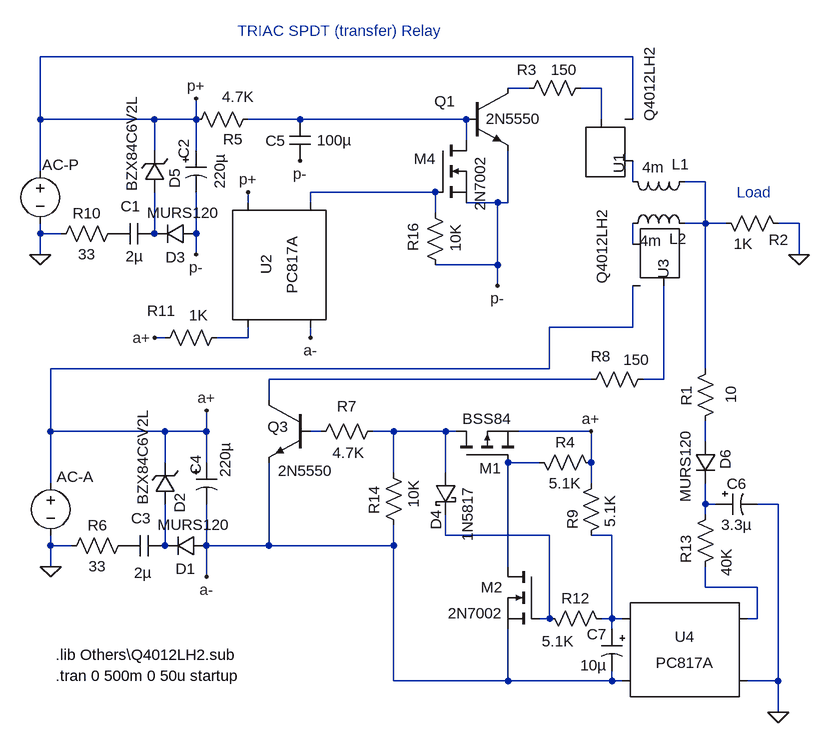
[diagram p0: schematic Simple SPDT Solid State Transfer Switch Using TRIACs (Brian Cornell).asc]
Simple SPDT Solid State Transfer Switch Using TRIACs (Brian Cornell).asc, the LTspice schematic file:
Version 4
SHEET 1 2328 916
WIRE 1696 -112 784 -112
WIRE 1536 -64 1504 -64
WIRE 1648 -64 1616 -64
WIRE 784 -16 784 -112
WIRE 960 -16 784 -16
WIRE 1024 -16 1024 -48
WIRE 1024 -16 960 -16
WIRE 1184 -16 1104 -16
WIRE 1440 -16 1184 -16
WIRE 1648 -16 1648 -64
WIRE 1696 -16 1696 -112
WIRE 1440 16 1440 -16
WIRE 960 32 960 -16
WIRE 1024 32 1024 -16
WIRE 784 64 784 -16
WIRE 1696 80 1696 48
WIRE 1808 80 1776 80
WIRE 1392 96 1200 96
WIRE 1104 112 1104 96
WIRE 1200 112 1200 96
WIRE 1488 112 1440 112
WIRE 1504 112 1504 32
WIRE 1504 112 1488 112
WIRE 1392 128 1392 96
WIRE 1808 144 1808 80
WIRE 1808 144 1776 144
WIRE 1840 144 1808 144
WIRE 1952 144 1920 144
WIRE 784 160 784 144
WIRE 816 160 784 160
WIRE 960 160 960 96
WIRE 1024 160 1024 96
WIRE 1696 176 1696 144
WIRE 784 192 784 160
WIRE 1024 192 1024 160
WIRE 1952 192 1952 144
WIRE 1488 208 1488 112
WIRE 1488 208 1392 208
WIRE 1488 240 1488 208
WIRE 1696 304 1696 240
WIRE 1696 304 1568 304
WIRE 976 320 960 320
WIRE 1104 320 1104 304
WIRE 1104 320 1056 320
WIRE 1200 320 1200 304
WIRE 1568 368 1568 304
WIRE 1568 368 800 368
WIRE 1808 368 1808 144
WIRE 1632 384 1136 384
WIRE 1744 384 1744 240
WIRE 1744 384 1712 384
WIRE 1136 416 1136 384
WIRE 800 464 800 368
WIRE 976 464 800 464
WIRE 1040 464 1040 432
WIRE 1040 464 976 464
WIRE 1216 464 1200 464
WIRE 1328 464 1296 464
WIRE 1408 464 1328 464
WIRE 1424 464 1408 464
WIRE 1632 464 1520 464
WIRE 1808 480 1808 448
WIRE 976 512 976 464
WIRE 1040 512 1040 464
WIRE 1552 512 1504 512
WIRE 1632 512 1632 464
WIRE 1328 528 1328 464
WIRE 1408 528 1408 464
WIRE 800 544 800 464
WIRE 1632 544 1632 512
WIRE 1808 576 1808 544
WIRE 1824 576 1808 576
WIRE 1920 576 1888 576
WIRE 1808 592 1808 576
WIRE 1408 624 1408 592
WIRE 1568 624 1408 624
WIRE 1664 624 1632 624
WIRE 800 640 800 624
WIRE 832 640 800 640
WIRE 976 640 976 576
WIRE 1040 640 1040 576
WIRE 1136 640 1136 512
WIRE 1136 640 1040 640
WIRE 1328 640 1328 608
WIRE 1328 640 1136 640
WIRE 800 672 800 640
WIRE 1504 672 1504 512
WIRE 1040 688 1040 640
WIRE 1808 704 1808 672
WIRE 1888 704 1808 704
WIRE 1568 752 1568 624
WIRE 1568 752 1552 752
WIRE 1664 752 1664 624
WIRE 1664 752 1648 752
WIRE 1680 752 1664 752
WIRE 1888 752 1888 704
WIRE 1888 752 1872 752
WIRE 1664 768 1664 752
WIRE 1328 848 1328 640
WIRE 1504 848 1504 768
WIRE 1504 848 1328 848
WIRE 1664 848 1664 832
WIRE 1664 848 1504 848
WIRE 1680 848 1664 848
WIRE 1920 848 1920 576
WIRE 1920 848 1872 848
WIRE 1920 896 1920 848
FLAG 1104 96 p+
FLAG 1040 432 a+
FLAG 784 192 0
FLAG 800 672 0
FLAG 1952 192 0
FLAG 1024 -48 p+
FLAG 1024 192 p-
FLAG 1488 240 p-
FLAG 1040 688 a-
FLAG 1200 320 a-
FLAG 960 320 a+
FLAG 1184 48 p-
FLAG 1920 896 0
FLAG 1632 464 a+
SYMBOL voltage 784 48 R0
WINDOW 3 -151 53 Invisible 2
WINDOW 123 0 0 Left 0
WINDOW 39 0 0 Left 0
WINDOW 0 3 6 Left 2
SYMATTR Value SINE(0 170 60)
SYMATTR InstName AC-P
SYMBOL res 1936 160 M270
WINDOW 0 -25 15 VTop 2
WINDOW 3 0 70 VBottom 2
SYMATTR InstName R2
SYMATTR Value 1K
SYMBOL Misc\\TRIAC 1664 48 M180
WINDOW 0 11 -20 VRight 2
WINDOW 3 58 61 VRight 2
SYMATTR InstName U1
SYMATTR Value Q4012LH2
SYMBOL voltage 800 528 R0
WINDOW 3 -235 55 Invisible 2
WINDOW 123 0 0 Left 0
WINDOW 39 0 0 Left 0
WINDOW 0 9 6 Left 2
SYMATTR Value SINE(0 130 60 200m 0 180)
SYMATTR InstName AC-A
SYMBOL cap 960 144 R90
WINDOW 0 -11 37 VBottom 2
WINDOW 3 35 31 VTop 2
SYMATTR InstName C1
SYMATTR Value 2µ
SYMATTR SpiceLine V=250
SYMBOL res 800 176 R270
WINDOW 0 32 56 VTop 2
WINDOW 3 0 56 VBottom 2
SYMATTR InstName R10
SYMATTR Value 33
SYMBOL diode 1024 144 R90
WINDOW 0 68 32 VBottom 2
WINDOW 3 -32 20 VTop 2
SYMATTR InstName D3
SYMATTR Value MURS120
SYMBOL polcap 1008 32 R0
WINDOW 0 -3 -17 VRight 2
WINDOW 3 52 5 VRight 2
SYMATTR InstName C2
SYMATTR Value 220µ
SYMATTR SpiceLine V=25 Irms=370m Rser=0.24 Lser=0
SYMBOL zener 976 96 R180
WINDOW 0 -15 5 VRight 2
WINDOW 3 51 1 VRight 2
SYMATTR InstName D5
SYMATTR Value BZX84C6V2L
SYMBOL res 1120 -32 R90
WINDOW 0 62 39 VBottom 2
WINDOW 3 -34 31 VTop 2
SYMATTR InstName R5
SYMATTR Value 4.7K
SYMBOL res 1408 224 R180
WINDOW 0 50 37 VRight 2
WINDOW 3 -15 36 VRight 2
SYMATTR InstName R16
SYMATTR Value 10K
SYMBOL nmos 1392 16 R0
WINDOW 0 -33 29 Left 2
WINDOW 3 69 24 VRight 2
SYMATTR InstName M4
SYMATTR Value 2N7002
SYMBOL npn 1440 -64 R0
WINDOW 0 -49 20 Left 2
WINDOW 3 30 47 Left 2
SYMATTR InstName Q1
SYMATTR Value 2N5550
SYMBOL res 1632 -80 R90
WINDOW 0 3 99 VBottom 2
WINDOW 3 -28 42 VTop 2
SYMATTR InstName R3
SYMATTR Value 150
SYMBOL cap 976 624 R90
WINDOW 0 -11 37 VBottom 2
WINDOW 3 42 34 VTop 2
SYMATTR InstName C3
SYMATTR Value 2µ
SYMATTR SpiceLine V=250
SYMBOL res 816 656 R270
WINDOW 0 32 56 VTop 2
WINDOW 3 0 56 VBottom 2
SYMATTR InstName R6
SYMATTR Value 33
SYMBOL diode 1040 624 R90
WINDOW 0 67 32 VBottom 2
WINDOW 3 -32 20 VTop 2
SYMATTR InstName D1
SYMATTR Value MURS120
SYMBOL polcap 1024 512 R0
WINDOW 0 -1 -11 VRight 2
WINDOW 3 45 -31 VRight 2
SYMATTR InstName C4
SYMATTR Value 220µ
SYMATTR SpiceLine V=25 Irms=370m Rser=0.24 Lser=0
SYMBOL zener 992 576 R180
WINDOW 0 -7 -14 VRight 2
WINDOW 3 50 -1 VRight 2
SYMATTR InstName D2
SYMATTR Value BZX84C6V2L
SYMBOL res 1312 448 R90
WINDOW 0 -7 56 VBottom 2
WINDOW 3 33 53 VTop 2
SYMATTR InstName R7
SYMATTR Value 4.7K
SYMBOL npn 1200 416 M0
WINDOW 0 34 41 Left 2
WINDOW 3 -35 109 Left 2
SYMATTR InstName Q3
SYMATTR Value 2N5550
SYMBOL res 1728 368 R90
WINDOW 0 -4 81 VBottom 2
WINDOW 3 -30 26 VTop 2
SYMATTR InstName R8
SYMATTR Value 150
SYMBOL Optos\\PC817A 1152 208 R270
SYMATTR InstName U2
SYMBOL res 1072 304 R90
WINDOW 0 -10 101 VBottom 2
WINDOW 3 -34 44 VTop 2
SYMATTR InstName R11
SYMATTR Value 1K
SYMBOL ind 1680 64 M90
WINDOW 0 5 90 VBottom 2
WINDOW 3 -22 48 VTop 2
SYMATTR InstName L1
SYMATTR Value 4m
SYMBOL cap 1168 -16 R0
WINDOW 0 -37 33 Left 2
WINDOW 3 42 32 Left 2
SYMATTR InstName C5
SYMATTR Value 100µ
SYMBOL Misc\\TRIAC 1728 176 M0
WINDOW 0 -15 23 VRight 2
WINDOW 3 79 -56 VRight 2
SYMATTR InstName U3
SYMATTR Value Q4012LH2
SYMBOL pmos 1424 512 R270
WINDOW 0 -9 36 VRight 2
WINDOW 3 67 10 VRight 2
SYMATTR InstName M1
SYMATTR Value BSS84
SYMBOL nmos 1552 672 M0
SYMATTR InstName M2
SYMATTR Value 2N7002
SYMBOL schottky 1424 528 M0
WINDOW 0 31 88 VLeft 2
WINDOW 3 -18 105 VLeft 2
SYMATTR InstName D4
SYMATTR Value 1N5817
SYMATTR Description Diode
SYMATTR Type diode
SYMBOL res 1536 496 M90
WINDOW 0 0 56 VBottom 2
WINDOW 3 32 56 VTop 2
SYMATTR InstName R4
SYMATTR Value 5.1K
SYMBOL res 1616 640 M180
WINDOW 0 -13 55 VLeft 2
WINDOW 3 45 78 VLeft 2
SYMATTR InstName R9
SYMATTR Value 5.1K
SYMBOL res 1664 768 M270
WINDOW 0 32 56 VTop 2
WINDOW 3 -3 83 VBottom 2
SYMATTR InstName R12
SYMATTR Value 5.1K
SYMBOL res 1824 576 M0
WINDOW 0 46 91 VLeft 2
WINDOW 3 -16 111 VLeft 2
SYMATTR InstName R13
SYMATTR Value 40K
SYMBOL polcap 1824 560 M90
WINDOW 0 0 32 VBottom 2
WINDOW 3 32 32 VTop 2
SYMATTR InstName C6
SYMATTR Value 3.3µ
SYMBOL diode 1824 480 M0
WINDOW 0 -15 43 VLeft 2
WINDOW 3 47 93 VLeft 2
SYMATTR InstName D6
SYMATTR Value MURS120
SYMBOL polcap 1680 768 M0
SYMATTR InstName C7
SYMATTR Value 10µ
SYMBOL res 1824 352 M0
WINDOW 0 45 73 VLeft 2
WINDOW 3 -23 69 VLeft 2
SYMATTR InstName R1
SYMATTR Value 10
SYMBOL Optos\\PC817A 1776 800 M0
SYMATTR InstName U4
SYMBOL res 1344 624 R180
WINDOW 0 46 32 VRight 2
WINDOW 3 -15 42 VRight 2
SYMATTR InstName R14
SYMATTR Value 10K
SYMBOL ind 1792 160 M270
WINDOW 0 -23 26 VTop 2
WINDOW 3 5 68 VBottom 2
SYMATTR InstName L2
SYMATTR Value 4m
TEXT 808 808 Left 2 !.lib Others\\Q4012LH2.sub
TEXT 808 840 Left 2 !.tran 0 500m 0 50u startup
TEXT 1856 96 Left 2 ;Load
TEXT 1088 -152 Left 2 ;TRIAC SPDT (transfer) Relay

The netlist it stands for:
* Simple SPDT Solid State Transfer Switch Using TRIACs (Brian Cornell).asc
V§AC-P p+ 0 SINE(0 170 60)
R2 0 N005 1K
XU1 N004 N002 p+ Q4012LH2  ; pins MT2 G MT1
V§AC-A a+ 0 SINE(0 130 60 200m 0 180)
C1 N007 P001 2µ V=250
R10 0 P001 33
D3 p- N007 MURS120
C2 p+ p- 220µ V=25 Irms=370m Rser=0.24 Lser=0
D5 N007 p+ BZX84C6V2L
R5 N003 p+ 4.7K
R16 p- N006 10K
M4 N003 N006 p- p- 2N7002
Q1 N001 N003 p- 0 2N5550
R3 N002 N001 150
C3 N019 P002 2µ V=250
R6 0 P002 33
D1 a- N019 MURS120
C4 a+ a- 220µ V=25 Irms=370m Rser=0.24 Lser=0
D2 N019 a+ BZX84C6V2L
R7 N013 N012 4.7K
Q3 N010 N012 a- 0 2N5550
R8 N011 N010 150
XU2 N009 a- p+ N006 PC817 Igain=1m
R11 N009 a+ 1K
L1 N004 N005 4m
C5 N003 p- 100µ
XU3 N008 N011 a+ Q4012LH2  ; pins MT2 G MT1
M1 N013 N015 a+ a+ BSS84
M2 N015 N017 a- a- 2N7002
D4 N013 N017 1N5817
R4 N015 a+ 5.1K
R9 N018 a+ 5.1K
R12 N018 N017 5.1K
R13 N016 N020 40K
C6 N016 0 3.3µ
D6 N014 N016 MURS120
C7 N018 a- 10µ
R1 N005 N014 10
XU4 N020 0 N018 a- PC817 Igain=1m
R14 a- N013 10K
L2 N005 N008 4m
.model D D
.lib standard.dio
.model NPN NPN
.model PNP PNP
.lib standard.bjt
.model NMOS NMOS
.model PMOS PMOS
.lib standard.mos
.lib Others\Q4012LH2.sub
.tran 0 500m 0 50u startup
* Load
* TRIAC SPDT (transfer) Relay
.lib PC817.sub
.backanno
.end